# Altium schematic sheet analog.SchDoc
size A1; SheetNumber: 2; SheetTotal: 4
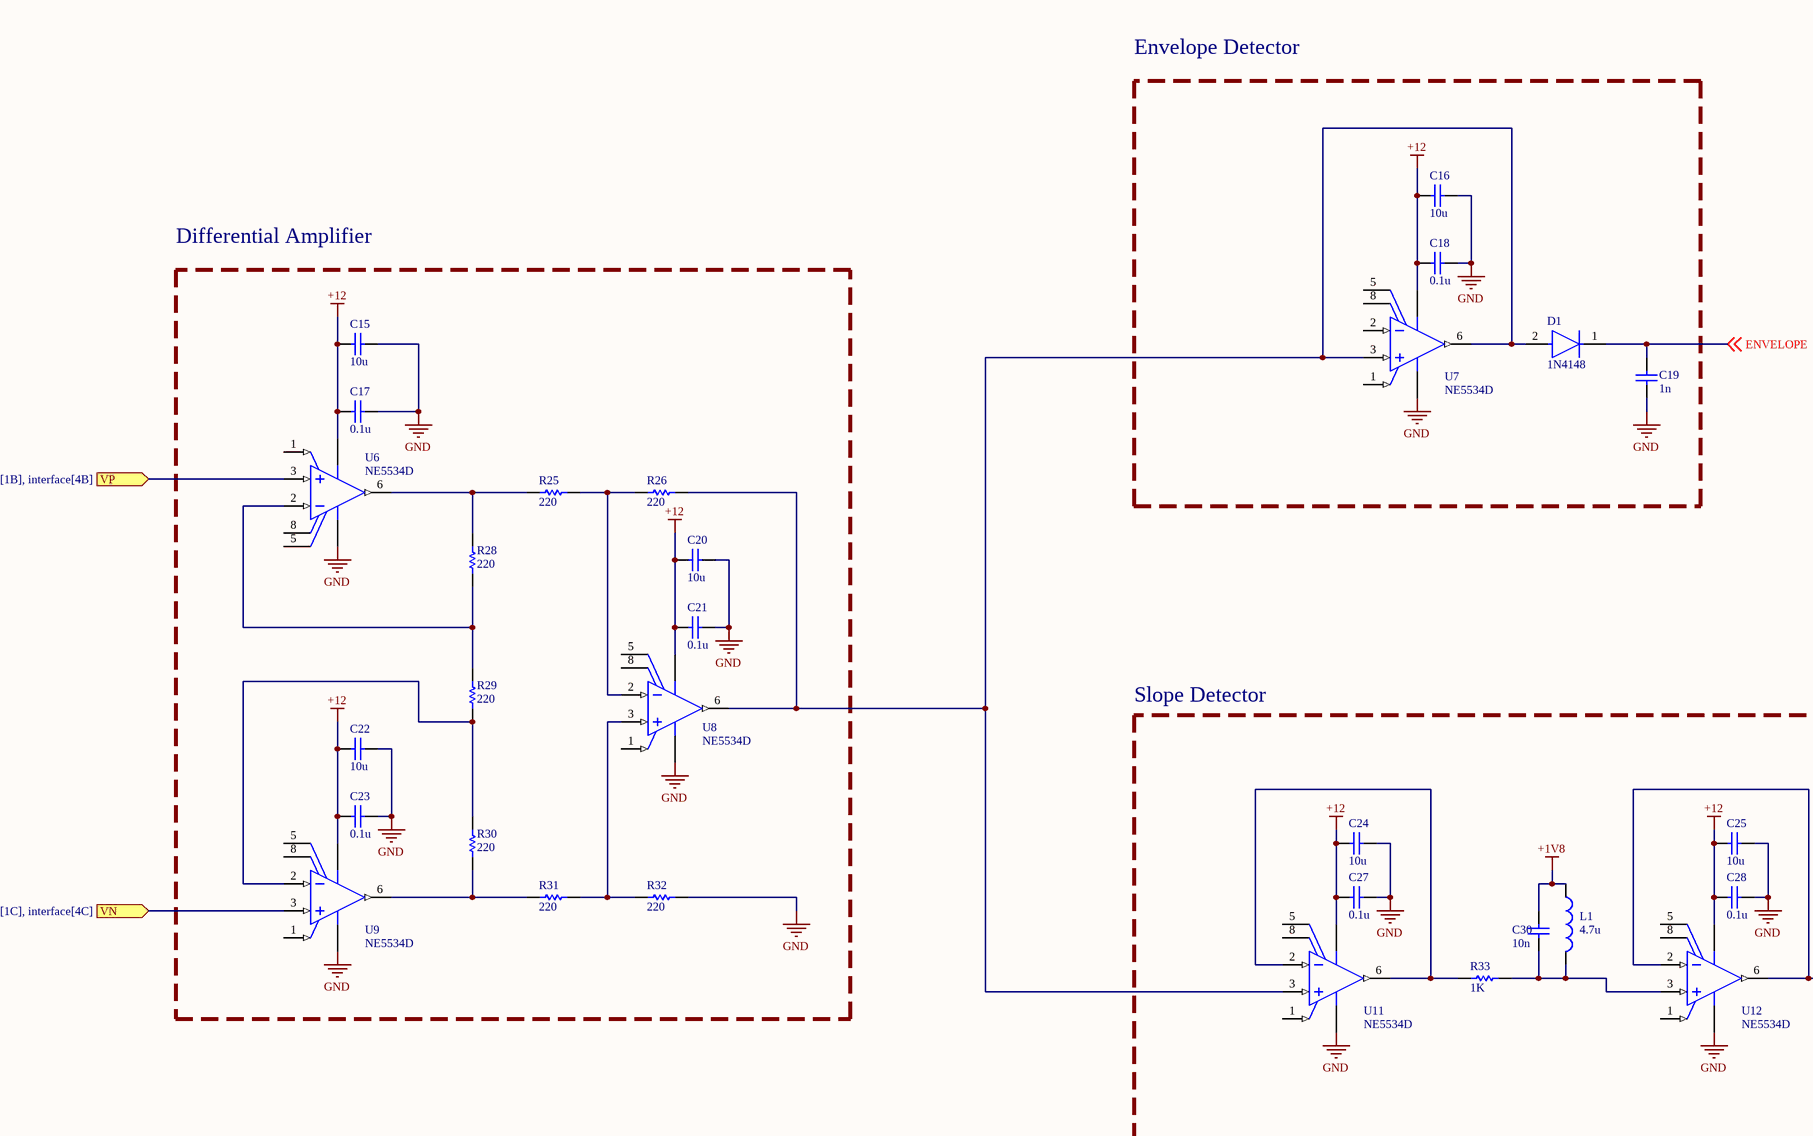
[diagram p0: analog.SchDoc, left]
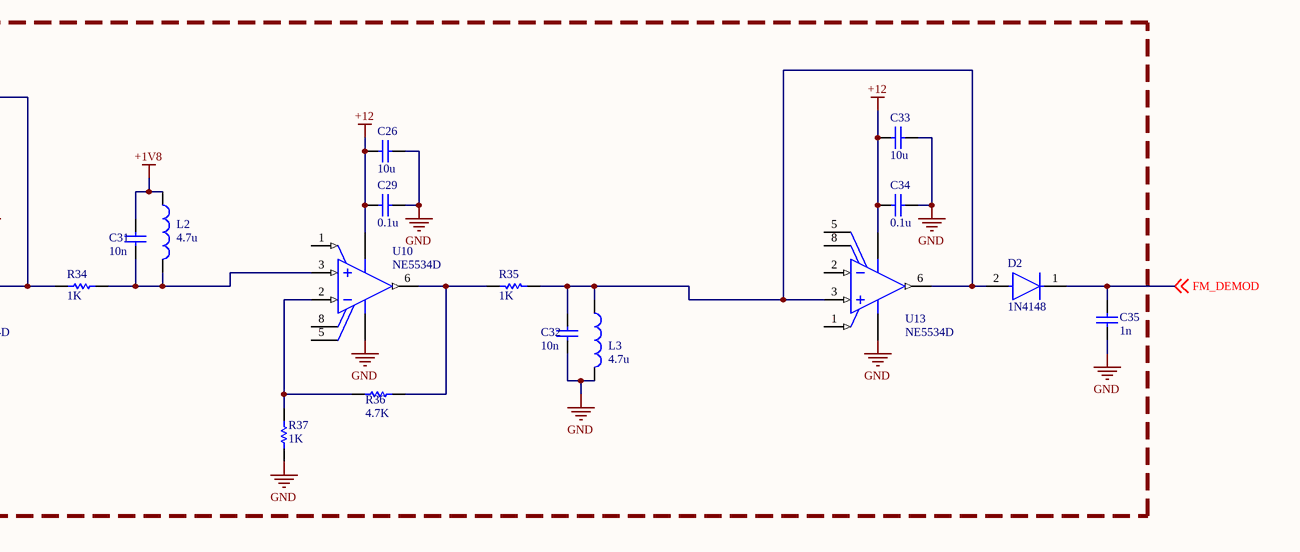
[diagram p1: analog.SchDoc, right]

## Parts
C15  value 10u  (hidden comment: Capacitor)
C16  value 10u  (hidden comment: Capacitor)
C17  value 0.1u  (hidden comment: Capacitor)
C18  value 0.1u  (hidden comment: Capacitor)
C19  value 1n  (hidden comment: Capacitor)
C20  value 10u  (hidden comment: Capacitor)
C21  value 0.1u  (hidden comment: Capacitor)
C22  value 10u  (hidden comment: Capacitor)
C23  value 0.1u  (hidden comment: Capacitor)
C24  value 10u  (hidden comment: Capacitor)
C25  value 10u  (hidden comment: Capacitor)
C26  value 10u  (hidden comment: Capacitor)
C27  value 0.1u  (hidden comment: Capacitor)
C28  value 0.1u  (hidden comment: Capacitor)
C29  value 0.1u  (hidden comment: Capacitor)
C30  value 10n  (hidden comment: Capacitor)
C31  value 10n  (hidden comment: Capacitor)
C32  value 10n  (hidden comment: Capacitor)
C33  value 10u  (hidden comment: Capacitor)
C34  value 0.1u  (hidden comment: Capacitor)
C35  value 1n  (hidden comment: Capacitor)
D1  1N4148  [FP-017AG-MFG]
D2  1N4148  [FP-017AG-MFG]
L1  value 4.7u  (hidden comment: Inductor)
L2  value 4.7u  (hidden comment: Inductor)
L3  value 4.7u  (hidden comment: Inductor)
R25  value 220  (hidden comment: Resistor)
R26  value 220  (hidden comment: Resistor)
R28  value 220  (hidden comment: Resistor)
R29  value 220  (hidden comment: Resistor)
R30  value 220  (hidden comment: Resistor)
R31  value 220  (hidden comment: Resistor)
R32  value 220  (hidden comment: Resistor)
R33  value 1K  (hidden comment: Resistor)
R34  value 1K  (hidden comment: Resistor)
R35  value 1K  (hidden comment: Resistor)
R36  value 4.7K  (hidden comment: Resistor)
R37  value 1K  (hidden comment: Resistor)
U6  NE5534D  [D0008A_N]
U7  NE5534D  [D0008A_N]
U8  NE5534D  [D0008A_N]
U9  NE5534D  [D0008A_N]
U10  NE5534D  [D0008A_N]
U11  NE5534D  [D0008A_N]
U12  NE5534D  [D0008A_N]
U13  NE5534D  [D0008A_N]

## Blocks framed on the sheet
Slope Detector: C24-C35 D2 L1-L3 R33-R37 U10-U13

## Ports
VN (in, see digital[1C], interface[4C]), VP (in, see digital[1B], interface[4B])

## Nets
+1V8: C30.2 C31.2 L1.1 L2.1
+12: C15.1 C16.1 C17.1 C18.1 C20.1 C21.1 C22.1 C23.1 C24.1 C25.1 C26.1 C27.1 C28.1 C29.1 C33.1 C34.1 U6.4(VCC-) U7.7(VCC+) U8.7(VCC+) U9.7(VCC+) U10.4(VCC-) U11.7(VCC+) U12.7(VCC+) U13.7(VCC+)
GND: C15.2 C16.2 C17.2 C18.2 C19.1 C20.2 C21.2 C22.2 C23.2 C24.2 C25.2 C26.2 C27.2 C28.2 C29.2 C32.2 C33.2 C34.2 C35.1 L3.1 R32.1 R37.2 U6.7(VCC+) U7.4(VCC-) U8.4(VCC-) U9.4(VCC-) U10.7(VCC+) U11.4(VCC-) U12.4(VCC-) U13.4(VCC-)
ENVELOPE: C19.2 D1.1(C) ; off-sheet ENVELOPE
FM_DEMOD: C35.2 D2.1(C) ; off-sheet FM_DEMOD
VN: U9.3(IN+) ; port VN
VP: U6.3(IN+) ; port VP
NetC30_1: C30.1 L1.2 R33.1 U12.3(IN+)
NetC31_1: C31.1 L2.2 R34.1 U10.3(IN+)
NetC32_1: C32.1 D2.2(A) L3.2 R35.1 U13.3(IN+) U13.6(OUT)
NetD1_2: D1.2(A) R26.1 U7.3(IN+) U7.6(OUT) U8.6(OUT) U11.3(IN+)
NetR25_1: R25.1 R26.2 U8.2(IN-)
NetR25_2: R25.2 R28.2 U6.6(OUT)
NetR28_1: R28.1 R29.2 U6.2(IN-)
NetR29_1: R29.1 R30.2 U9.2(IN-)
NetR30_1: R30.1 R31.2 U9.6(OUT)
NetR31_1: R31.1 R32.2 U8.3(IN+)
NetR33_2: R33.2 U11.2(IN-) U11.6(OUT)
NetR34_2: R34.2 U12.2(IN-) U12.6(OUT)
NetR35_2: R35.2 R36.1 U10.6(OUT)
NetR36_2: R36.2 R37.1 U10.2(IN-)

Not connected (* = marked no-connect by the designer): U6 1(BALANCE) 5(COMP) 8(COMP/BAL); U7 1(BALANCE) 2(IN-) 5(COMP) 8(COMP/BAL); U8 1(BALANCE) 5(COMP) 8(COMP/BAL); U9 1(BALANCE) 5(COMP) 8(COMP/BAL); U10 1(BALANCE) 5(COMP) 8(COMP/BAL); U11 1(BALANCE) 5(COMP) 8(COMP/BAL); U12 1(BALANCE) 5(COMP) 8(COMP/BAL); U13 1(BALANCE) 2(IN-) 5(COMP) 8(COMP/BAL)

## Notes on the sheet
- Envelope Detector
- Differential Amplifier

## Library data of the parts
C15-C35 = Capacitor: SimulationGenericComponent: True
D1 D2 = CMP-07163-000046-1: DIODE GEN PURP 100V 200MA DO35; Forward Voltage: 1V; Max Power Dissipation: 500mW; Max Reverse Current: 5uA; Forward Current: 300mA; Current: 4A; Reverse Recovery Time: 4ns; Element Configuration: Single; Outside Diameter: 1.85mm; Capacitance: 4pF; Polarity: Standard; Max Forward Surge Current (Ifsm): 1A; Reverse Voltage: 100V; Output Current: 200mA; Average Rectified Current: 200mA; Diameter: 1.91mm; Max Repetitive Reverse Voltage (Vrrm): 100V; Current Rating: 200mA; Case/Package: DO-35; Lead Free: Lead Free; Number of Pins: 2; Recovery Time: 4ns; Packaging: Bulk; Contact Plating: Tin; Voltage: 100V; Mount: Through Hole; Max Surge Current: 4A; Package Quantity: 2000; Width: 1.91mm; Max Reverse Voltage (DC): 100V; Length: 4.56mm; Radiation Hardening: No; Power Dissipation: 500mW; Voltage Rating (DC): 100V; Peak Non-Repetitive Surge Current: 4A; REACH SVHC: No SVHC; Height: 4.56mm; Max Operating Temperature: 175°C; Series: -; Weight: 0.01lb; Min Operating Temperature: -65°C
L1-L3 = Inductor: SimulationGenericComponent: True
R25 R26 R28-R37 = Resistor: TC1: 0; SimulationGenericComponent: True; TC2: 0
U6-U13 = CMP-0017-00431-2: Low-Noise High-Speed Audio Operational Amplifier, 10 to 30 V, 0 to 70 degC, 8-pin SOIC (D8), Green (RoHS & no Sb/Br); Manufacturer: Texas Instruments; Sub Family: General Purpose Amplifier, High Supply Voltage Amplifier (>=30V), Low Noise Amp (<=10nV/rtHz); Total Supply Voltage(Max)(+5V is 5, +/-5V is 10): 30; CMRR(Min)(dB): 70; Number of Channels: 1; IIB(Max)(pA): 1500000; Vio (25C)(Max)(mV): 4; Total Supply Voltage(Min)(+5V is 5, +/-5V is 10): 10; Iq per channel(Max)(mA): 8; Slew Rate(Typ)(V/us): 13; PackageVersion: 4040047-3/M, 06/2011; Mounting Technology: Surface Mount; DatasheetVersion: SLOS070C; ComponentLink1URL: http://www.ti.com/; ComponentLink3Description: Package Specification; Eco-Plan: Green (RoHS & no Sb/Br); ComponentLink3URL: http://www.ti.com/litv/pdf/msoi002j; ComponentLink2URL: http://www.ti.com/lit/ds/symlink/ne5534.pdf; Code_JEDEC: MS-012; PartNumber: NE5534D; ComponentLink2Description: Datasheet; GBW(Typ)(MHz): 10; PackageDescription: 8-Pin Plastic Small Outline, Body 4.9 x 3.9 mm, Pitch 1.27 mm; PackageReference: D0008A; Vn at 1kHz(Typ)(nV/rtHz): 4; ComponentLink1Description: Manufacturer URL